# Altium schematic sheet MCU.SchDoc
size A
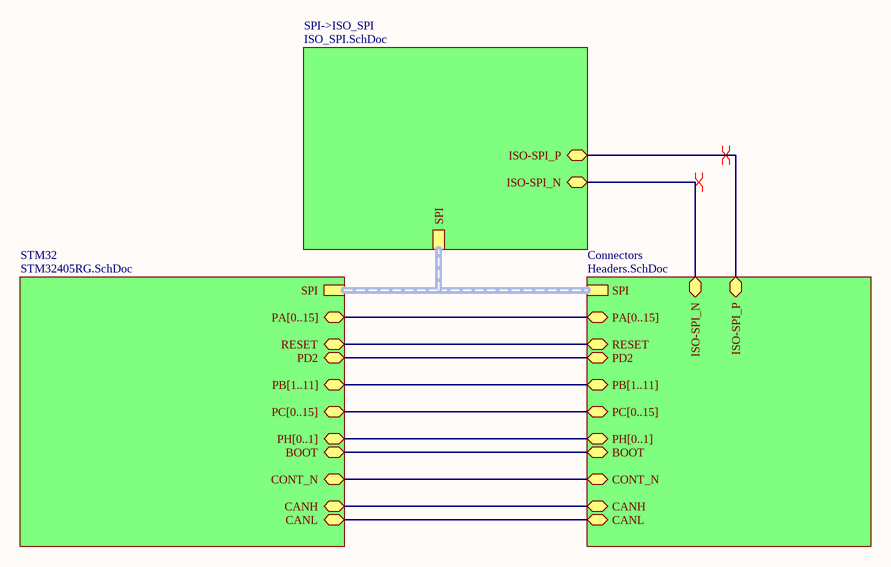
[diagram p0: MCU.SchDoc]

## Sub-sheets
Connectors = Headers.SchDoc: PA[0..15] (bidir), RESET (bidir), PB[1..11] (bidir), PC[0..15] (bidir), PH[0..1] (bidir), PD2 (bidir), SPI (harness SPI), BOOT (bidir), ISO-SPI_P (bidir), ISO-SPI_N (bidir), CONT_N (bidir), CANH (bidir), CANL (bidir)
SPI->ISO_SPI = ISO_SPI.SchDoc: SPI (harness SPI), ISO-SPI_N (bidir), ISO-SPI_P (bidir)
STM32 = STM32405RG.SchDoc: PA[0..15] (bidir), PB[1..11] (bidir), RESET (bidir), PC[0..15] (bidir), PH[0..1] (bidir), PD2 (bidir), SPI (harness SPI), CONT_N (bidir), BOOT (bidir), CANH (bidir), CANL (bidir)

## Nets
(unnamed): sheet STM32/RESET, sheet Connectors/RESET
(unnamed): sheet STM32/PD2, sheet Connectors/PD2
(unnamed): sheet STM32/CONT_N, sheet Connectors/CONT_N
(unnamed): sheet STM32/BOOT, sheet Connectors/BOOT
(unnamed): sheet STM32/CANH, sheet Connectors/CANH
(unnamed): sheet STM32/CANL, sheet Connectors/CANL
(unnamed): sheet Connectors/ISO-SPI_P, sheet SPI->ISO_SPI/ISO-SPI_P
(unnamed): sheet Connectors/ISO-SPI_N, sheet SPI->ISO_SPI/ISO-SPI_N

## Buses and harness runs
bus sheet Connectors/PA[0..15] = sheet STM32/PA[0..15]
bus sheet Connectors/PB[1..11] = sheet STM32/PB[1..11]
bus sheet Connectors/PC[0..15] = sheet STM32/PC[0..15]
bus sheet Connectors/PH[0..1] = sheet STM32/PH[0..1]
harness sheet Connectors/SPI = sheet SPI->ISO_SPI/SPI = sheet STM32/SPI

## Layout directives
differential pair: (no net found under the mark)